# Altium schematic sheet Peripherials.SchDoc: Peripherials
size A4; Author: Miłosz Werner; Organization: Wrocław University of Science and Technology; Revision: 1.0; SheetNumber: 4; SheetTotal: 5
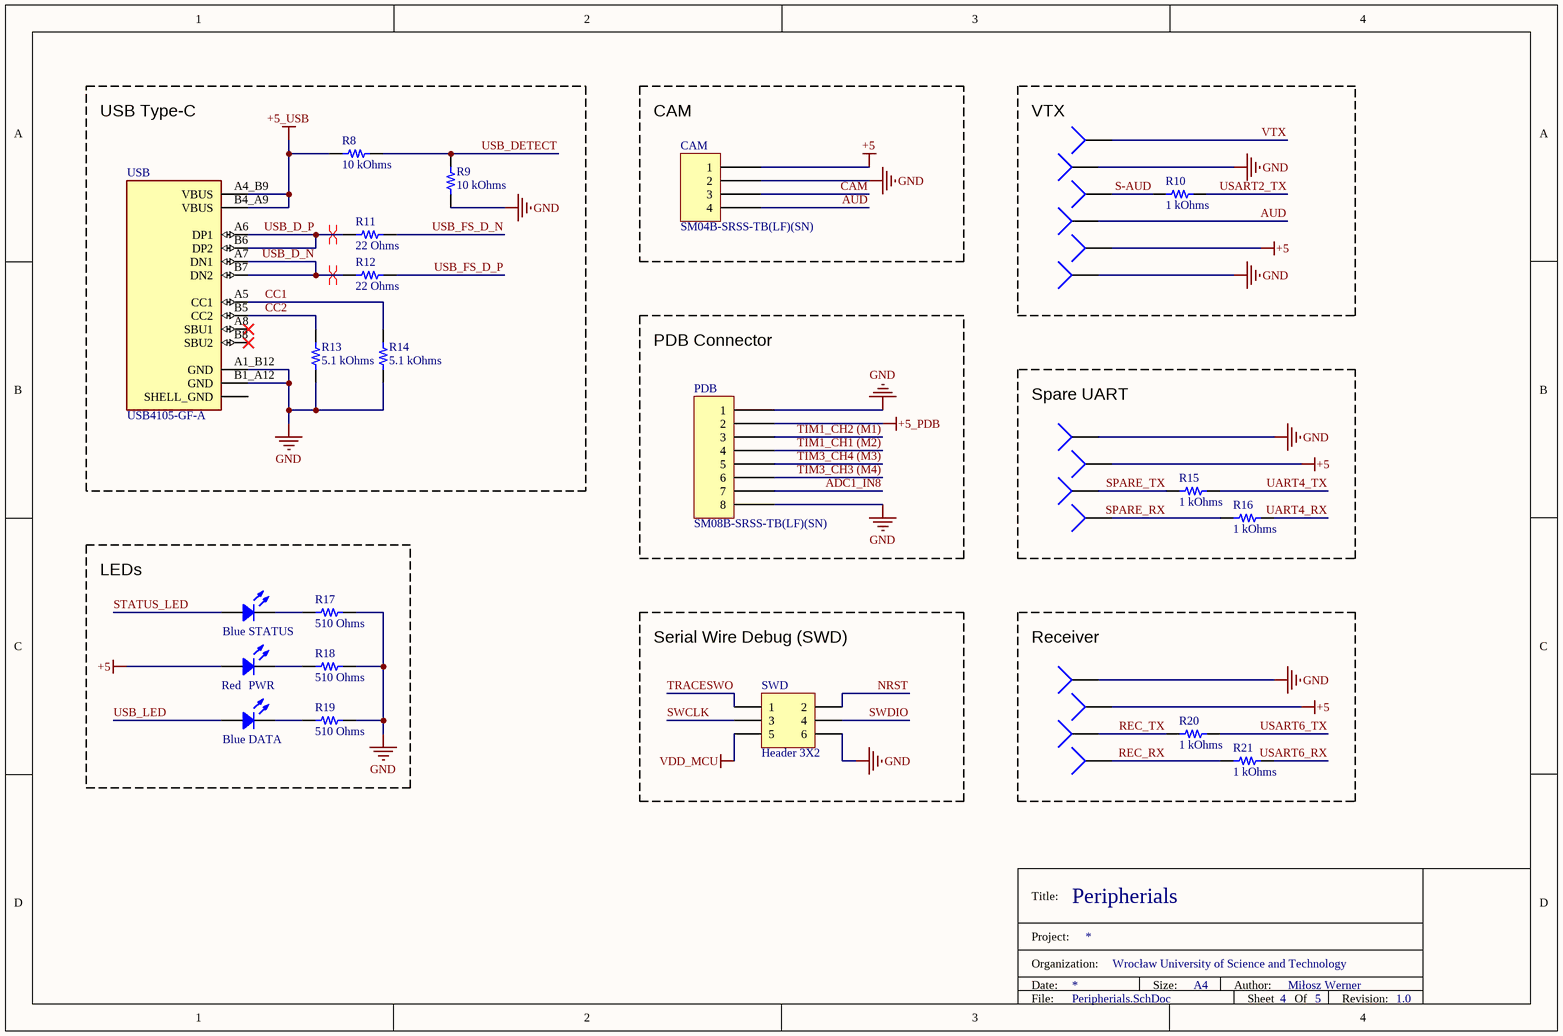
[diagram p0: Peripherials.SchDoc]

## Parts
CAM  SM04B-SRSS-TB(LF)(SN)  [JST SM04B-SRSS-TB]
DATA  Blue  [LED 0603_1608 BLUE]
J1  Socket  [PIN1]  (value not drawn)
J2  Socket  [PIN1]  (value not drawn)
J3  Socket  [PIN1]  (value not drawn)
J4  Socket  [PIN1]  (value not drawn)
J5  Socket  [PIN1]  (value not drawn)
J6  Socket  [PIN1]  (value not drawn)
J7  Socket  [PIN1]  (value not drawn)
J8  Socket  [PIN1]  (value not drawn)
J9  Socket  [PIN1]  (value not drawn)
J10  Socket  [PIN1]  (value not drawn)
J11  Socket  [PIN1]  (value not drawn)
J12  Socket  [PIN1]  (value not drawn)
J13  Socket  [PIN1]  (value not drawn)
J14  Socket  [PIN1]  (value not drawn)
PDB  SM08B-SRSS-TB(LF)(SN)  [JST SM08B-SRSS-TB]
PWR  Red  [LED 0603_1608 RED]
R8  10 kOhms  [RES 0603_1608]
R9  10 kOhms  [RES 0603_1608]
R10  1 kOhms  [RES 0603_1608]
R11  22 Ohms  [RES 0603_1608]
R12  22 Ohms  [RES 0603_1608]
R13  5.1 kOhms  [RES 0603_1608]
R14  5.1 kOhms  [RES 0603_1608]
R15  1 kOhms  [RES 0603_1608]
R16  1 kOhms  [RES 0603_1608]
R17  510 Ohms  [RES 0603_1608]
R18  510 Ohms  [RES 0603_1608]
R19  510 Ohms  [RES 0603_1608]
R20  1 kOhms  [RES 0603_1608]
R21  1 kOhms  [RES 0603_1608]
STATUS  Blue  [LED 0603_1608 BLUE]
SWD  Header 3X2  [HDR2X3]
USB  USB4105-GF-A  [GCT_USB4105-GF-A]

## Blocks framed on the sheet
USB Type-C: R8 R9 R11-R14 USB
CAM: CAM
VTX: J1-J6 R10
PDB Connector: PDB
Spare UART: J7-J10 R15 R16
LEDs: DATA PWR R17-R19 STATUS
Serial Wire Debug (SWD): SWD
Receiver: J11-J14 R20 R21

## Nets
+5: CAM.1 J5.1 J8.1 J12.1 PWR.1
+5_PDB: PDB.2
+5_USB: R8.2 USB.A4_B9(VBUS) USB.B4_A9(VBUS)
GND: CAM.2 J2.1 J6.1 J7.1 J11.1 PDB.1 PDB.8 R9.2 R13.2 R14.2 R17.2 R18.2 R19.2 SWD.6 USB.A1_B12(GND) USB.B1_A12(GND)
VDD_MCU: SWD.5
ADC1_IN8: PDB.7
AUD: CAM.4 J4.1
CAM: CAM.3
CC1: R14.1 USB.A5(CC1)
CC2: R13.1 USB.B5(CC2)
NRST: SWD.2
REC_RX: J14.1 R21.1
REC_TX: J13.1 R20.1
S-AUD: J3.1 R10.1
SPARE_RX: J10.1 R16.1
SPARE_TX: J9.1 R15.1
STATUS_LED: STATUS.1
SWCLK: SWD.3
SWDIO: SWD.4
TIM1_CH1 (M2): PDB.4
TIM1_CH2 (M1): PDB.3
TIM3_CH3 (M4): PDB.6
TIM3_CH4 (M3): PDB.5
TRACESWO: SWD.1
UART4_RX: R16.2
UART4_TX: R15.2
USART2_TX: R10.2
USART6_RX: R21.2
USART6_TX: R20.2
USB_D_N: R12.1 USB.A7(DN1) USB.B7(DN2)
USB_D_P: R11.1 USB.A6(DP1) USB.B6(DP2)
USB_DETECT: R8.1 R9.1
USB_FS_D_N: R11.2
USB_FS_D_P: R12.2
USB_LED: DATA.1
VTX: J1.1
NetDATA_2: DATA.2 R19.1
NetPWR_2: PWR.2 R18.1
NetR17_1: R17.1 STATUS.2

Not connected (* = marked no-connect by the designer): USB ?1(SHELL_GND) A8(SBU1)* B8(SBU2)*

## Layout directives
differential pair: USB_D_N, USB_D_P

## Notes on the sheet
- Title:
- Date:
- File:
- Project:
- Organization:
- Size:
- A4
- Author:
- Sheet
- Of
- Revision:

## Library data of the parts
CAM = SM04B-SRSS-TB(LF)(SN): CONN HEADER SMD R/A 4POS 1MM; Manufacturer: JST Sales America Inc.; Current Rating (Amps): 0.7A; Material Flammability Rating: UL94 V-0; Number of Positions: 4; Number of Positions Loaded: All; Pitch - Mating: 0.039" (1.00mm); Shrouding: Shrouded - 4 Wall; Style: Board to Cable/Wire; Voltage Rating: 50V; Part Number: SM04B-SRSS-TB(LF)(SN); ComponentLink1Description: Datasheet; ComponentLink1URL: http://www.jst-mfg.com/product/pdf/eng/eSH.pdf; ComponentLink2Description: DigiKey Link; ComponentLink2URL: http://digikey.com/product-detail/en/jst-sales-america-inc/SM04B-SRSS-TB-LF-SN/455-1804-1-ND/926875; Connector Type: Header; Contact Finish - Mating: Tin; Contact Finish - Post: Tin; Contact Material: Copper Alloy; Contact Shape: Square; Contact Type: Male Pin; Fastening Type: Push-Pull; Features: Solder Retention; Insulation Color: Natural; Insulation Height: 0.114" (2.90mm); Insulation Material: Polyamide (PA), Nylon; LastUpdated: 12.01.2020 23:41:52; Lifecycle Status: Active; Minimum Order: 1; Mounting Type: Surface Mount, Right Angle; Number of Rows: 1; Operating Temperature: -25°C ~ 85°C; Packaging: TapeAndReel; PartId: 62; Part Status: Active; Price: 0.26; Series: SR; Supplier 1: DigiKey; Supplier Part Number 1: 455-1804-1-ND; Termination: Solder
DATA STATUS = QBLP601-IB: LED BLUE CLEAR 0603 SMD; Manufacturer: QT Brightek (QTB); Configuration: Standard; Current - Test: 20mA; Lens Color: Colorless; Lens Size: 1.10mm x 0.80mm; Lens Style: Rectangle with Flat Top; Millicandela Rating: 90mcd; Voltage - Forward (Vf) (Typ): 3.2V; Wavelength - Dominant: 470nm; Part Number: QBLP601-IB; Color: Blue; ComponentLink1Description: Datasheet; ComponentLink1URL: http://www.qt-brightek.com/datasheet/QBLP601_series.pdf; ComponentLink2Description: DigiKey Link; ComponentLink2URL: https://www.digikey.com/en/products/detail/qt-brightek-qtb/QBLP601-IB/4814652; Device Package: 0603 (1608 Metric); Height (Max): 0.60mm; LastUpdated: 19.09.2022 13:49:29; Lens Transparency: Clear; Lifecycle Status: Active; Minimum Order: 1; Mounting Type: Surface Mount; Package / Case: 0603 (1608 Metric); Packaging: TapeAndReel; PartId: 784; Part Status: Active; Price: 0.05; Series: QBLP601; Size / Dimension: 1.60mm L x 0.80mm W; Supplier 1: DigiKey; Supplier Part Number 1: 1516-1054-1-ND; Supplier Device Package: 0603; Value: Blue
PDB = SM08B-SRSS-TB(LF)(SN): CONN HEADER SMD R/A 8POS 1MM; Manufacturer: JST Sales America Inc.; Current Rating (Amps): 0.7A; Material Flammability Rating: UL94 V-0; Number of Positions: 8; Number of Positions Loaded: All; Pitch - Mating: 0.039" (1.00mm); Shrouding: Shrouded - 4 Wall; Style: Board to Cable/Wire; Voltage Rating: 50V; Part Number: SM08B-SRSS-TB(LF)(SN); ComponentLink1Description: Datasheet; ComponentLink1URL: http://www.jst-mfg.com/product/pdf/eng/eSH.pdf; ComponentLink2Description: DigiKey Link; ComponentLink2URL: http://digikey.com/product-detail/en/jst-sales-america-inc/SM08B-SRSS-TB-LF-SN/455-1808-1-ND/926879; Connector Type: Header; Contact Finish - Mating: Tin; Contact Finish - Post: Tin; Contact Material: Copper Alloy; Contact Shape: Square; Contact Type: Male Pin; Fastening Type: Push-Pull; Features: Solder Retention; Insulation Color: Natural; Insulation Height: 0.114" (2.90mm); Insulation Material: Polyamide (PA), Nylon; LastUpdated: 12.01.2020 23:42:39; Lifecycle Status: Active; Minimum Order: 1; Mounting Type: Surface Mount, Right Angle; Number of Rows: 1; Operating Temperature: -25°C ~ 85°C; Packaging: TapeAndReel; PartId: 66; Part Status: Active; Price: 0.41; Series: SR; Supplier 1: DigiKey; Supplier Part Number 1: 455-1808-1-ND; Termination: Solder
PWR = QBLP601-R: LED RED CLEAR 0603 SMD; Manufacturer: QT Brightek (QTB); Configuration: Standard; Current - Test: 20mA; Lens Color: Colorless; Lens Size: 1.10mm x 0.80mm; Lens Style: Rectangle with Flat Top; Millicandela Rating: 100mcd; Viewing Angle: 140°; Voltage - Forward (Vf) (Typ): 2V; Wavelength - Dominant: 625nm; Part Number: QBLP601-R; Color: Red; ComponentLink1Description: Datasheet; ComponentLink1URL: http://www.qt-brightek.com/datasheet/QBLP601_series.pdf; ComponentLink2Description: DigiKey Link; ComponentLink2URL: https://www.digikey.com/en/products/detail/qt-brightek-qtb/QBLP601-R/4814657; Device Package: 0603 (1608 Metric); Height (Max): 0.60mm; LastUpdated: 19.09.2022 13:50:25; Lens Transparency: Clear; Lifecycle Status: Active; Minimum Order: 1; Mounting Type: Surface Mount; Package / Case: 0603 (1608 Metric); Packaging: TapeAndReel; PartId: 383; Part Status: Active; Price: 0.05; Series: QBLP601; Size / Dimension: 1.60mm L x 0.80mm W; Supplier 1: DigiKey; Supplier Part Number 1: 1516-1059-1-ND; Supplier Device Package: 0603; Value: Red
R8 R9 = RS73F1JTTD1002B: RES 10K OHM 0.1% 1/5W 0603; Manufacturer: KOA Speer Electronics, Inc.; Power (Watts): 0.2W, 1/5W; Temperature Coefficient: ±25ppm/°C; Part Number: RS73F1JTTD1002B; Value: 10 kOhms; ComponentLink1Description: Datasheet; ComponentLink1URL: http://www.koaspeer.com/pdfs/RS73.pdf; ComponentLink2Description: DigiKey Link; ComponentLink2URL: https://www.digikey.com/en/products/detail/koa-speer-electronics-inc/RS73F1JTTD1002B/11594389; Composition: Thick Film; Device Package: 0603 (1608 Metric); Features: Automotive AEC-Q200, Moisture Resistant; Height - Seated (Max): 0.022" (0.55mm); LastUpdated: 15.07.2022 11:48:43; Lifecycle Status: Active; Minimum Order: 1; Number of Terminations: 2; Operating Temperature: -55°C ~ 155°C; Package / Case: 0603 (1608 Metric); Packaging: TapeAndReel; PartId: 56378; Part Status: Active; Price: 0.08; Ratings: AEC-Q200; Resistance: 10 kOhms; Series: RS73; Size / Dimension: 0.063" L x 0.031" W (1.60mm x 0.80mm); Supplier 1: DigiKey; Supplier Part Number 1: 2019-RS73F1JTTD1002BCT-ND; Supplier Device Package: 0603; Tolerance: ±0.1%
R10 R15 R16 R20 R21 = SG73S1JTTD1001F: RES 1K OHM 1% 1/5W 0603; Manufacturer: KOA Speer Electronics, Inc.; Power (Watts): 0.2W, 1/5W; Temperature Coefficient: ±100ppm/°C; Part Number: SG73S1JTTD1001F; Value: 1 kOhms; ComponentLink1Description: Datasheet; ComponentLink1URL: http://www.koaspeer.com/catimages/Products/SG73S/SG73S.pdf; ComponentLink2Description: DigiKey Link; ComponentLink2URL: https://www.digikey.com/en/products/detail/koa-speer-electronics-inc/SG73S1JTTD1001F/10279992; Composition: Thick Film; Device Package: 0603 (1608 Metric); Features: Automotive AEC-Q200, Moisture Resistant, Pulse Withstanding; Height - Seated (Max): 0.022" (0.55mm); LastUpdated: 19.09.2022 13:20:55; Lifecycle Status: Active; Minimum Order: 1; Number of Terminations: 2; Operating Temperature: -55°C ~ 155°C; Package / Case: 0603 (1608 Metric); Packaging: TapeAndReel; PartId: 26528; Part Status: Active; Price: 0.01; Ratings: AEC-Q200; Resistance: 1 kOhms; Series: SG73S; Size / Dimension: 0.063" L x 0.031" W (1.60mm x 0.80mm); Supplier 1: DigiKey; Supplier Part Number 1: 2019-SG73S1JTTD1001FCT-ND; Supplier Device Package: 0603; Tolerance: ±1%
R11 R12 = RMCF0603FT22R0: RES 22 OHM 1% 1/10W 0603; Manufacturer: Stackpole Electronics Inc; Power (Watts): 0.1W, 1/10W; Temperature Coefficient: ±100ppm/°C; Part Number: RMCF0603FT22R0; Value: 22 Ohms; ComponentLink1Description: Datasheet; ComponentLink1URL: https://www.seielect.com/catalog/sei-packaging.pdf; ComponentLink2Description: DigiKey Link; ComponentLink2URL: https://www.digikey.com/en/products/detail/stackpole-electronics-inc/RMCF0603FT22R0/1760726; Composition: Thick Film; Device Package: 0603 (1608 Metric); Features: Automotive AEC-Q200; Height - Seated (Max): 0.022" (0.55mm); LastUpdated: 19.09.2022 13:22:13; Lifecycle Status: Active; Minimum Order: 1; Number of Terminations: 2; Operating Temperature: -55°C ~ 155°C; Package / Case: 0603 (1608 Metric); Packaging: CutTape; PartId: 10611; Part Status: Active; Price: 0.01; Ratings: AEC-Q200; Resistance: 22 Ohms; Series: RMCF; Size / Dimension: 0.061" L x 0.031" W (1.55mm x 0.80mm); Supplier 1: DigiKey; Supplier Part Number 1: RMCF0603FT22R0CT-ND; Supplier Device Package: 0603; Tolerance: ±1%
R13 R14 = RK73H1JRTTD5101F: RES 5.1 KOHM 1% 1/10W 0603; Manufacturer: KOA Speer Electronics, Inc.; Power (Watts): 0.1W, 1/10W; Temperature Coefficient: ±100ppm/°C; Part Number: RK73H1JRTTD5101F; Value: 5.1 kOhms; ComponentLink1Description: Datasheet; ComponentLink1URL: https://www.koaspeer.com/pdfs/RK73-RT.pdf; ComponentLink2Description: DigiKey Link; ComponentLink2URL: https://www.digikey.com/en/products/detail/koa-speer-electronics-inc/RK73H1JRTTD5101F/12314799; Composition: Thick Film; Device Package: 0603 (1608 Metric); Features: Anti-Sulfur, Automotive AEC-Q200, Moisture Resistant; Height - Seated (Max): 0.022" (0.55mm); LastUpdated: 19.09.2022 13:20:25; Lifecycle Status: Active; Minimum Order: 1; Number of Terminations: 2; Operating Temperature: -55°C ~ 155°C; Package / Case: 0603 (1608 Metric); Packaging: TapeAndReel; PartId: 65375; Part Status: Active; Price: 0.01; Ratings: AEC-Q200; Resistance: 5.1 kOhms; Series: RK73-RT; Size / Dimension: 0.063" L x 0.031" W (1.60mm x 0.80mm); Supplier 1: DigiKey; Supplier Part Number 1: 2019-RK73H1JRTTD5101FCT-ND; Supplier Device Package: 0603; Tolerance: ±1%
R17-R19 = RK73B1JTTD511J: RES 510 OHM 5% 1/8W 0603; Manufacturer: KOA Speer Electronics, Inc.; Power (Watts): 0.125W, 1/8W; Temperature Coefficient: ±200ppm/°C; Part Number: RK73B1JTTD511J; Value: 510 Ohms; ComponentLink1Description: Datasheet; ComponentLink1URL: http://www.koaspeer.com/catimages/Products/RK73B/RK73B.pdf; ComponentLink2Description: DigiKey Link; ComponentLink2URL: https://www.digikey.com/en/products/detail/koa-speer-electronics-inc/RK73B1JTTD511J/9844735; Composition: Thick Film; Device Package: 0603 (1608 Metric); Features: Automotive AEC-Q200; Height - Seated (Max): 0.022" (0.55mm); LastUpdated: 19.09.2022 13:22:30; Lifecycle Status: Active; Minimum Order: 1; Number of Terminations: 2; Operating Temperature: -55°C ~ 155°C; Package / Case: 0603 (1608 Metric); Packaging: CutTape; PartId: 5988; Part Status: Active; Price: 0.01; Ratings: AEC-Q200; Resistance: 510 Ohms; Series: RK73B; Size / Dimension: 0.063" L x 0.031" W (1.60mm x 0.80mm); Supplier 1: DigiKey; Supplier Part Number 1: 2019-RK73B1JTTD511JCT-ND; Supplier Device Package: 0603; Tolerance: ±5%
SWD = Header 3X2: Header, 3-Pin, Dual row; LatestRevisionDate: 17-Jul-2002; LatestRevisionNote: Re-released for DXP Platform.; Publisher: Altium Limited
USB = USB4105-GF-A: USB-C (USB TYPE-C) USB 2.0 Receptacle Connector 24 (16+8 Dummy) Position Surface Mount, Right Angle; Through Hole; MF: {'manufacturer': u'GCT'}; MP: USB4105-GF-A; Value: *; Package: None; Price: None; Availability: Unavailable
J1-J14 = Socket: LatestRevisionDate: 17-Jul-2002; LatestRevisionNote: Re-released for DXP Platform.; Publisher: Altium Limited